# Altium schematic sheet TTL_USB.SchDoc
size A; SheetNumber: 5; SheetTotal: 8
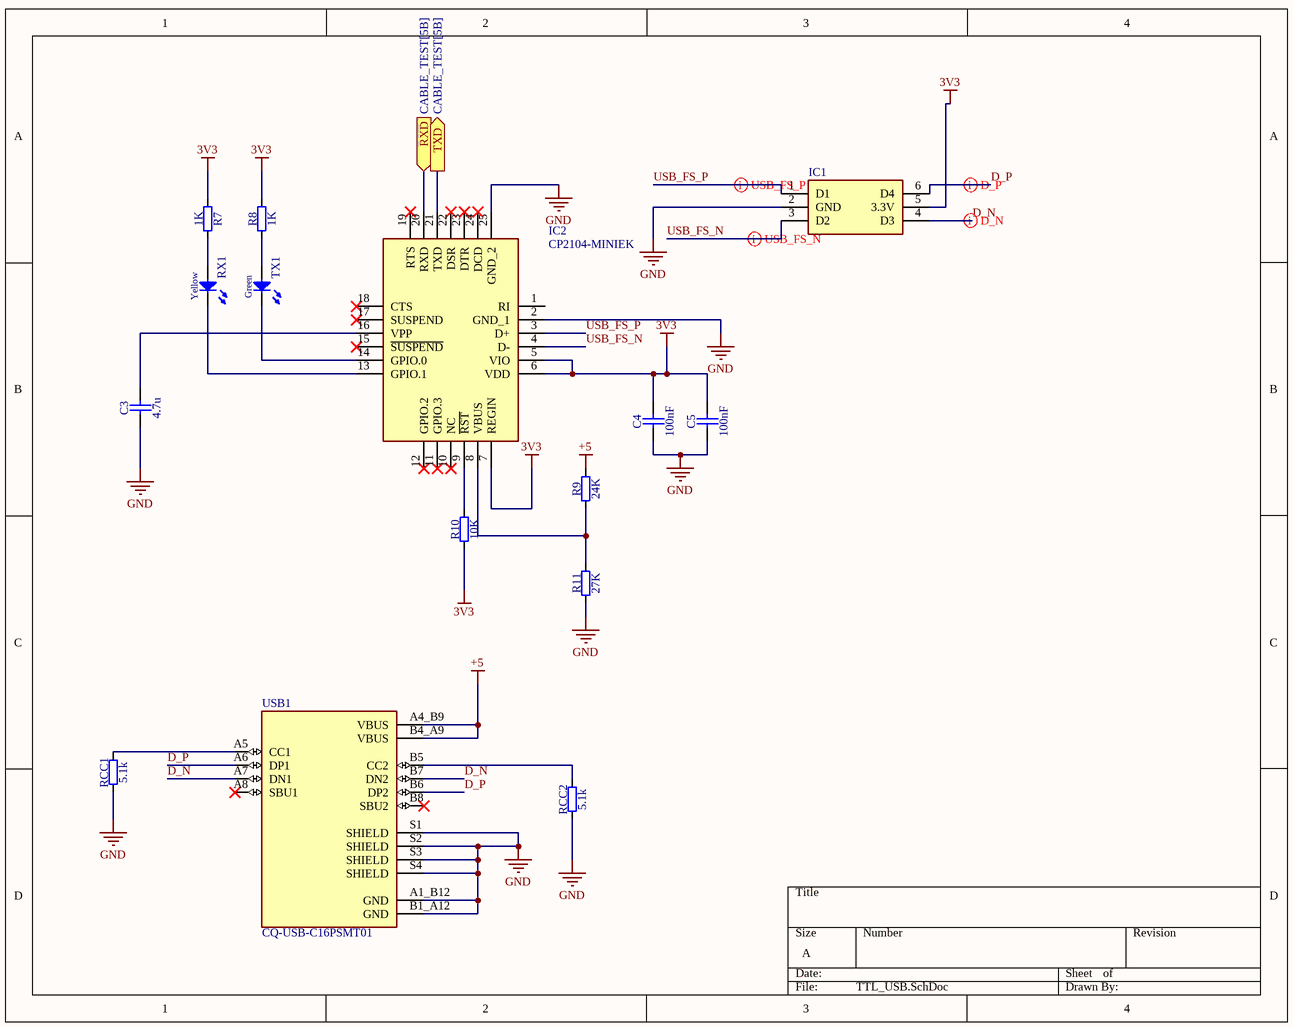
[diagram p0: TTL_USB.SchDoc]

## Parts
C3  4.7u  [CAPC2012X135N]
C4  100nF  [CAPC2012X135N]
C5  100nF  [CAPC2012X135N]
IC1  (no value)  [SOT65P210X110-6N]
IC2  CP2104-MINIEK  [QFN50P400X400X80-25N-D]
R7  1K  [RESC2012X60N]
R8  1K  [RESC2012X60N]
R9  24K  [RESC2012X60N]
R10  10K  [RESC2012X60N]
R11  27K  [RESC2012X60N]
RCC1  5.1k  [RESC2012X60N]
RCC2  5.1k  [RESC2012X60N]
RX1  Yellow  [LED_3MM_YELLOW_1C-2A]
TX1  Green  [LED_3MM_GREEN_1C-2A]
USB1  CQ-USB-C16PSMT01  [SHENZHEN-CHUANGQIN-TECHNOLOGY_CQ-USB-C16PSMT01]

## Ports
RXD (in, see CABLE_TEST[5B]), TXD (out, see CABLE_TEST[5B])

## Nets
3V3: C4.2 C5.2 IC1.5(3.3V) IC2.5(VIO) IC2.6(VDD) IC2.7(REGIN) R7.1 R8.2 R10.1
+5: R9.2 USB1.A4_B9(VBUS) USB1.B4_A9(VBUS)
GND: C3.1 C4.1 C5.1 IC1.2(GND) IC2.2(GND_1) IC2.25(GND_2) R11.1 RCC1.1 RCC2.1 USB1.A1_B12(GND) USB1.B1_A12(GND) USB1.S1(SHIELD) USB1.S2(SHIELD) USB1.S3(SHIELD) USB1.S4(SHIELD)
D_N: IC1.4(D3) USB1.A7(DN1) USB1.B7(DN2)
D_P: IC1.6(D4) USB1.A6(DP1) USB1.B6(DP2)
RXD: IC2.20(RXD) ; port RXD
TXD: IC2.21(TXD) ; port TXD
USB_FS_N: IC1.3(D2) IC2.4(D-)
USB_FS_P: IC1.1(D1) IC2.3(D+)
NetC3_2: C3.2 IC2.16(VPP)
NetIC2_8: IC2.8(VBUS) R9.1 R11.2
NetIC2_9: IC2.9(~{RST}) R10.2
NetIC2_13: IC2.13(GPIO.1) RX1.1(C)
NetIC2_14: IC2.14(GPIO.0) TX1.1(C)
NetR7_2: R7.2 RX1.2(A)
NetR8_1: R8.1 TX1.2(A)
NetRCC1_2: RCC1.2 USB1.A5(CC1)
NetRCC2_2: RCC2.2 USB1.B5(CC2)

Not connected (* = marked no-connect by the designer): IC2 1(RI) 10(NC)* 11(GPIO.3)* 12(GPIO.2)* 15(~{SUSPEND})* 17(SUSPEND)* 18(CTS)* 19(RTS)* 22(DSR)* 23(DTR)* 24(DCD)*; USB1 A8(SBU1)* B8(SBU2)*

## Layout directives
differential pair: D_N, D_P, USB_FS_N, USB_FS_P

## Library data of the parts
C3-C5 = CC0805_100NF_50V_10%_X7R: Non-polarised capacitor; Part Description: SMD Multilayer Chip Ceramic Capacitor; Manufacturer: GENERIC; Manufacturer1 Part Number: C2012X7R1H104K085; Voltage: 50V; TC: X7R; Tolerance: ±10%; Part Number: CC0805_100NF_50V_10%_X7R; Component Kind: Standard; Component Type: Standard; Pin Count: 2; Status: None; Manufacturer Part Number: CC0805_100NF_50V_10%_X7R; Case: 0805; Mounted: Yes; Socket: No; SMD: Yes; Sense: No; Manufacturer1 Example: TDK; Manufacturer1 ComponentHeight: 1mm; HelpURL: \\cern.ch\dfs\Applications\Altium\Datasheets\CC0805_X7R_TDK_C.pdf; Author: CERN DEM JLC; CreateDate: 12/3/2007; LatestRevisionDate: 4/22/2015
  C3: Value: 4.7u
  C4 C5: Value: 100nF
IC1 = USBUF02W6: Integrated Circuit; IPN: 1245; Voltage: 8KV; Category: Diode; Mounting Type: SMD
IC2 = CP2104-MINIEK: Integrated Circuit; Manufacturer_Name: Silicon Labs; Datasheet Link: https://www.silabs.com/documents/public/data-sheets/cp2104.pdf; Height: 0.8mm; Manufacturer_Part_Number: CP2104-MINIEK; Mouser Part Number: 634-CP2104-MINIEK; Mouser Price/Stock: https://www.mouser.co.uk/ProductDetail/Silicon-Labs/CP2104-MINIEK?qs=FYfXKmhrYXPeBq%2FwIaWTFg%3D%3D; Arrow Part Number: CP2104-MINIEK; Arrow Price/Stock: https://www.arrow.com/en/products/cp2104-miniek/silicon-labs?utm_currency=USD&region=nac
R7-R11 RCC1 RCC2 = R0805_24K_1%_0.125W_100PPM: Resistor - 1%; Part Description: General Purpose Thick Film Chip Resistor; Manufacturer: GENERIC; Manufacturer1 Part Number: NRC10F2402TRF; Power: 0.125W; TC: ±100ppm/°C; PressFit: No; Part Number: R0805_24K_1%_0.125W_100PPM; Component Kind: Standard; Component Type: Standard; Pin Count: 2; Status: Preferred; Tolerance: ±1%; Manufacturer Part Number: R0805_24K_1%_0.125W_100PPM; Case: 0805; Mounted: Yes; Sense: No; Socket: No; SMD: Yes; HelpURL: \\cern.ch\dfs\Applications\Altium\Datasheets\R0805_NIC_NRC.pdf; Author: CERN DEM JLC; CreateDate: 12/3/2007; LatestRevisionDate: 3/13/2008; Manufacturer1 Example: NIC COMPONENT; Manufacturer1 ComponentHeight: 0.6mm
  R7 R8: Value: 1K
  R9: Value: 24K
  R10: Value: 10K
  R11: Value: 27K
  RCC1 RCC2: Value: 5.1k
RX1 = LED_AVAGO_HLMP-1719: LED Yellow 1C 2A; Part Description: 3mm Yellow LED; Manufacturer: AVAGO TECHNOLOGIES; PressFit: No; Bonding: No; Part Number: LED_AVAGO_HLMP-1719; Component Kind: Standard; Component Type: Standard; Color: Yellow; PackageDescription: LED, Yellow, Body Dia. 3.43 mm, Pin spacing 2.54mm; Manufacturer Part Number: HLMP-1719; Pin Count: 2; Mounted: Yes; Socket: No; SMD: No; Sense: No; ComponentHeight: 6.35mm(min); HelpURL: \\cern.ch\dfs\Applications\Altium\Datasheets\LED_AVAGO_HLMP-1719.pdf; Author: CERN DEM JLC; CreateDate: 6/12/2008; LatestRevisionDate: 3/17/2010
TX1 = LED_AVAGO_HLMP-1790: LED Green 1C 2A; Part Description: 3mm Green LED; Manufacturer: AVAGO TECHNOLOGIES; PressFit: No; Bonding: No; Part Number: LED_AVAGO_HLMP-1790; Component Kind: Standard; Component Type: Standard; Color: Green; PackageDescription: LED, Green, Body Dia. 3.43 mm, Pin spacing 2.54mm; Manufacturer Part Number: HLMP-1790; Pin Count: 2; Mounted: Yes; Socket: No; SMD: No; Sense: No; ComponentHeight: 6.35mm(min); HelpURL: \\cern.ch\dfs\Applications\Altium\Datasheets\LED_AVAGO_HLMP-1790.pdf; Author: CERN DEM JLC; CreateDate: 6/12/2008; LatestRevisionDate: 3/17/2010
USB1 = CQ-USB-C16PSMT01: C Type USB Type-C Female Plug 16 Pin Connector Power Charger Jack Port; MF: Shenzen Chuangqin Technology; SnapEDA_Link: https://www.snapeda.com/parts/CQ-USB-C16PSMT01/Shenzen+Chuangqin+Technology/view-part/?ref=snap; Package: Package; Value: *; MP: CQ-USB-C16PSMT01; Check_prices: https://www.snapeda.com/parts/CQ-USB-C16PSMT01/Shenzen+Chuangqin+Technology/view-part/?ref=eda